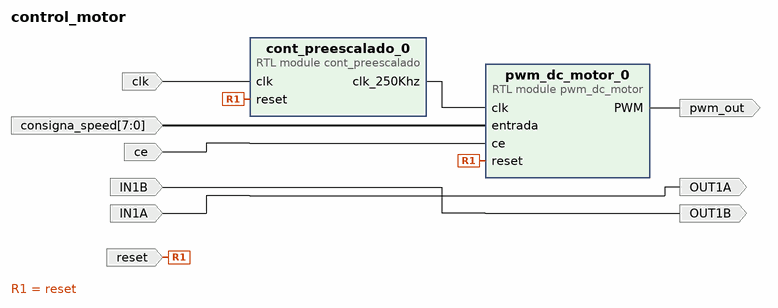
[diagram p0: block diagram of the top level]
# Vivado block design control_motor, xc7z020clg484-1, Vivado 2017.4
create_bd_design control_motor

create_bd_port -dir I -from 7 -to 0 consigna_speed
create_bd_port -dir I ce
create_bd_port -dir I reset
create_bd_port -dir I clk
create_bd_port -dir I IN1A
create_bd_port -dir I IN1B
create_bd_port -dir O OUT1A
create_bd_port -dir O OUT1B
create_bd_port -dir O pwm_out

create_bd_cell -type module -reference pwm_dc_motor pwm_dc_motor_0
create_bd_cell -type module -reference cont_preescalado cont_preescalado_0

# ---- connections ----

connect_bd_net [get_bd_pins cont_preescalado_0/clk_250Khz] [get_bd_pins pwm_dc_motor_0/clk]
connect_bd_net [get_bd_ports consigna_speed] [get_bd_pins pwm_dc_motor_0/entrada]
connect_bd_net [get_bd_ports ce] [get_bd_pins pwm_dc_motor_0/ce]
connect_bd_net [get_bd_ports reset] [get_bd_pins pwm_dc_motor_0/reset] [get_bd_pins cont_preescalado_0/reset]
connect_bd_net [get_bd_ports clk] [get_bd_pins cont_preescalado_0/clk]
connect_bd_net [get_bd_ports IN1B] [get_bd_ports OUT1B]
connect_bd_net [get_bd_ports IN1A] [get_bd_ports OUT1A]
connect_bd_net [get_bd_pins pwm_dc_motor_0/PWM] [get_bd_ports pwm_out]

validate_bd_design
save_bd_design
